# Altium schematic sheet Power.SchDoc
size A4; Organization: Q-Tech Design; Address1: Da Nang City; Address2: Viet Nam; DocumentNumber: 7; SheetNumber: 7; SheetTotal: 7
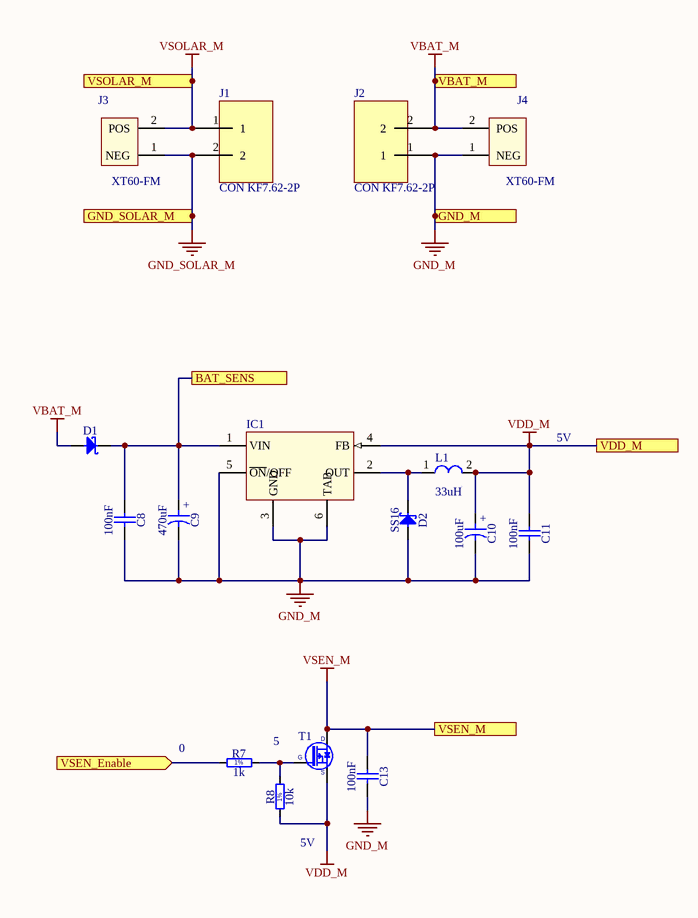
[diagram p0: Power.SchDoc]

## Parts
C8  100nF  [CAPC1608X87N]
C9  470uF  [CAPAE1030X1020N]
C10  100uF  [CAPMP6032X280N]
C11  100nF  [CAPC1608X87N]
C13  100nF  [CAPC1608X87N]
D1  SS16  [DIOM5127X229N]  (value not drawn)
D2  SS16  [DIOM5127X229N]
IC1  LM2596  [TO263-5]  (value not drawn)
J1  CON KF7.62-2P  [CON KF7.62-2P]
J2  CON KF7.62-2P  [CON KF7.62-2P]
J3  XT60-FM  [XT60-FM]
J4  XT60-FM  [XT60-FM]
L1  33uH  [L_SMD]
R7  1k  [RESC1608X55N]
R8  10k  [RESC1608X55N]
T1  BSH203  [SOT95P230X110-3N]  (value not drawn)

## Ports
BAT_SENS, GND_M, GND_SOLAR_M, VBAT_M, VDD_M, VSEN_Enable (in), VSEN_M, VSOLAR_M

## Nets
GND_M: C8.2 C9.2 C10.2 C11.2 C13.2 D2.2(A) IC1.3(GND) IC1.5(~{ON}/OFF) IC1.6(TAB) J2.1 J4.1(NEG) ; port GND_M
GND_SOLAR_M: J1.2 J3.1(NEG) ; port GND_SOLAR_M
VBAT_M: D1.2(A) J2.2 J4.2(POS) ; port VBAT_M
VDD_M: C10.1 C11.1 IC1.4(FB) L1.2 R8.1 T1.2(S) ; port VDD_M
VSEN_M: C13.1 T1.3(D) ; port VSEN_M
VSOLAR_M: J1.1 J3.2(POS) ; port VSOLAR_M
BAT_SENS: C8.1 C9.1 D1.1(C) IC1.1(VIN) ; port BAT_SENS
VSEN_Enable: R7.1 ; port VSEN_Enable
NetD2_1: D2.1(C) IC1.2(OUT) L1.1
NetR7_2: R7.2 R8.2 T1.1(G)

## Notes on the sheet
- 5V
- 5
- (near R7) 0
- (near R8) 5V
- Page Title:
- Date:
- Title:
- DRE:
- Time:
- Number:
- Sheet
- Rev:
- of
- Q-Tech confidential and proprietary. Restricted access under NDA. Do not reproduce. Store and dispose securely.
- (in symbol CAE1030-1020_470UF_25V_20%) +
- (in symbol CTE6032-28_100UF_6.3V_10%_LESR0075) +
- (in symbol R0603_1K_1%_0.1W_100PPM) 1%
- (in symbol R0603_10K_1%_0.1W_100PPM) 1%

## Library data of the parts
C8 C11 C13 = CC0603_100NF_50V_10%_X7R: Non-polarised capacitor; Part Description: SMD Multilayer Chip Ceramic Capacitor; Manufacturer: GENERIC; Manufacturer1 Part Number: 223858615649; Voltage: 50V; TC: X7R; Tolerance: ±10%; Table: Capacitors SMD; Part Number: CC0603_100NF_50V_10%_X7R; Component Kind: Standard; Component Type: Standard; Pin Count: 2; Value: 100nF; Status: Preferred; Manufacturer Part Number: CC0603_100NF_50V_10%_X7R; Case: 0603; Mounted: Yes; Socket: No; SMD: Yes; Manufacturer1 Example: PHYCOMP; Manufacturer1 ComponentHeight: 0.87mm; HelpURL: \\cern.ch\dfs\Applications\Altium\Datasheets\CC0603_X7R_PHYCOMP.pdf; Author: CERN DEM JLC; CreateDate: 03-Dec-07; LatestRevisionDate: 03-Dec-07
C9 = CAE1030-1020_470UF_25V_20%: Polarised capacitor; Part Description: Aluminum Electrolytic SMT Capacitor; Manufacturer: GENERIC; Manufacturer1 Part Number: EEEFK1E471AP; Voltage: 25V; Tolerance: ±20%; Table: Capacitors SMD; Part Number: CAE1030-1020_470UF_25V_20%; Component Kind: Standard; Component Type: Standard; Pin Count: 2; Value: 470uF; Status: Not Recommended; Manufacturer Part Number: CAE1030-1020_470UF_25V_20%; Case: G; Mounted: Yes; Socket: No; SMD: Yes; Manufacturer1 Example: PANASONIC; Manufacturer1 ComponentHeight: 10.2mm; HelpURL: \\cern.ch\dfs\Applications\Altium\Datasheets\CAE_PANASONIC_FK.pdf; Author: CERN DEM JLC; CreateDate: 03-Dec-07; LatestRevisionDate: 03-Dec-07
C10 = CTE6032-28_100UF_6.3V_10%_LESR0075: Polarised capacitor; Part Description: Low ESR 0R075 Solid Tantalum Chip Capacitor; Manufacturer: GENERIC; Manufacturer1 Part Number: TPSC107K006R0075; Voltage: 6.3V; Tolerance: ±10%; Table: Capacitors SMD; Part Number: CTE6032-28_100UF_6.3V_10%_LESR0075; Component Kind: Standard; Component Type: Standard; Pin Count: 2; Value: 100uF; Status: Preferred; Manufacturer Part Number: CTE6032-28_100UF_6.3V_10%_LESR0075; Case: C; Mounted: Yes; Socket: No; SMD: Yes; Manufacturer1 Example: AVX; Manufacturer1 ComponentHeight: 2.8mm; HelpURL: \\cern.ch\dfs\Applications\Altium\Datasheets\CTE-LESR_AVX_TPS.pdf; Author: CERN DEM JLC; CreateDate: 05-May-08; LatestRevisionDate: 20-Jan-09
D1 D2 = SS16: Schottky Diode; Part Description: Surface Mount Schottky Barrier Rectifier; Manufacturer: VISHAY GENERAL SEMICONDUCTOR; Voltage: 60V; Power: 1A; Table: Diodes; Part Number: SS16; Component Kind: Standard; Component Type: Standard; Device: SS16; PackageDescription: DO-214-AC Molded Diode, Body 5.1x2.7mm, IPC Medium Density; Manufacturer Part Number: SS16; Pin Count: 2; Case: DO-214AC; Mounted: Yes; Socket: No; SMD: Yes; ComponentHeight: 2.29mm; HelpURL: \\cern.ch\dfs\Applications\Altium\Datasheets\SS16.pdf; Author: CERN DEM JLC; CreateDate: 15-Jul-08; LatestRevisionDate: 23-Aug-10
IC1 = LM2596-5V
J3 J4 = XT60-FM: MF: AMASS; MP: XT60-M; SnapEDA_Link: https://www.snapeda.com/parts/XT60-M/AMASS/view-part/?ref=snap; Price: None; Availability: Unavailable; Package: Package Analog Devices; Value: *
L1 = L_SMD 33uH
R7 = R0603_1K_1%_0.1W_100PPM: Resistor - 1%; Part Description: General Purpose Thick Film Chip Resistor; Manufacturer: GENERIC; Manufacturer1 Part Number: NRC06F1001TRF; Power: 0.1W; TC: ±100ppm/°C; Table: Resistors SMD; Part Number: R0603_1K_1%_0.1W_100PPM; Component Kind: Standard; Component Type: Standard; Pin Count: 2; Value: 1k; Status: Preferred; Tolerance: ±1%; Manufacturer Part Number: R0603_1K_1%_0.1W_100PPM; Case: 0603; Mounted: Yes; Socket: No; SMD: Yes; Manufacturer1 Example: NIC COMPONENT; Manufacturer1 ComponentHeight: 0.55mm; HelpURL: \\cern.ch\dfs\Applications\Altium\Datasheets\R0603_NIC_NRC.pdf; Author: CERN DEM JLC; CreateDate: 03-Dec-07; LatestRevisionDate: 13-Mar-08
R8 = R0603_10K_1%_0.1W_100PPM: Resistor - 1%; Part Description: General Purpose Thick Film Chip Resistor; Manufacturer: GENERIC; Manufacturer1 Part Number: NRC06F1002TRF; Power: 0.1W; TC: ±100ppm/°C; Table: Resistors SMD; Part Number: R0603_10K_1%_0.1W_100PPM; Component Kind: Standard; Component Type: Standard; Pin Count: 2; Value: 10k; Status: Preferred; Tolerance: ±1%; Manufacturer Part Number: R0603_10K_1%_0.1W_100PPM; Case: 0603; Mounted: Yes; Socket: No; SMD: Yes; Manufacturer1 Example: NIC COMPONENT; Manufacturer1 ComponentHeight: 0.55mm; HelpURL: \\cern.ch\dfs\Applications\Altium\Datasheets\R0603_NIC_NRC.pdf; Author: CERN DEM JLC; CreateDate: 03-Dec-07; LatestRevisionDate: 13-Mar-08
T1 = BSH203: P-CHANNEL MOSFET WITH DIODE; Part Description: -30V -470mA P-Channel Enhancement Mode MOS Transistor; Manufacturer: NXP SEMICONDUCTORS; Table: Transistors; Part Number: BSH203; Component Kind: Standard; Component Type: Standard; Device: BSH203; PackageDescription: SOT23, 3 pin, Pitch 0.95mm - 1.3mm W X 2.9mm L X 1.1mm H, IPC Medium Density; Manufacturer Part Number: BSH203; Pin Count: 3; Case: SOT23-3; Mounted: Yes; Socket: No; SMD: Yes; ComponentHeight: 1.1mm; HelpURL: \\cern.ch\dfs\Applications\Altium\Datasheets\BSH203.pdf; Author: CERN DEM JLC; CreateDate: 10-May-10; LatestRevisionDate: 10-May-10